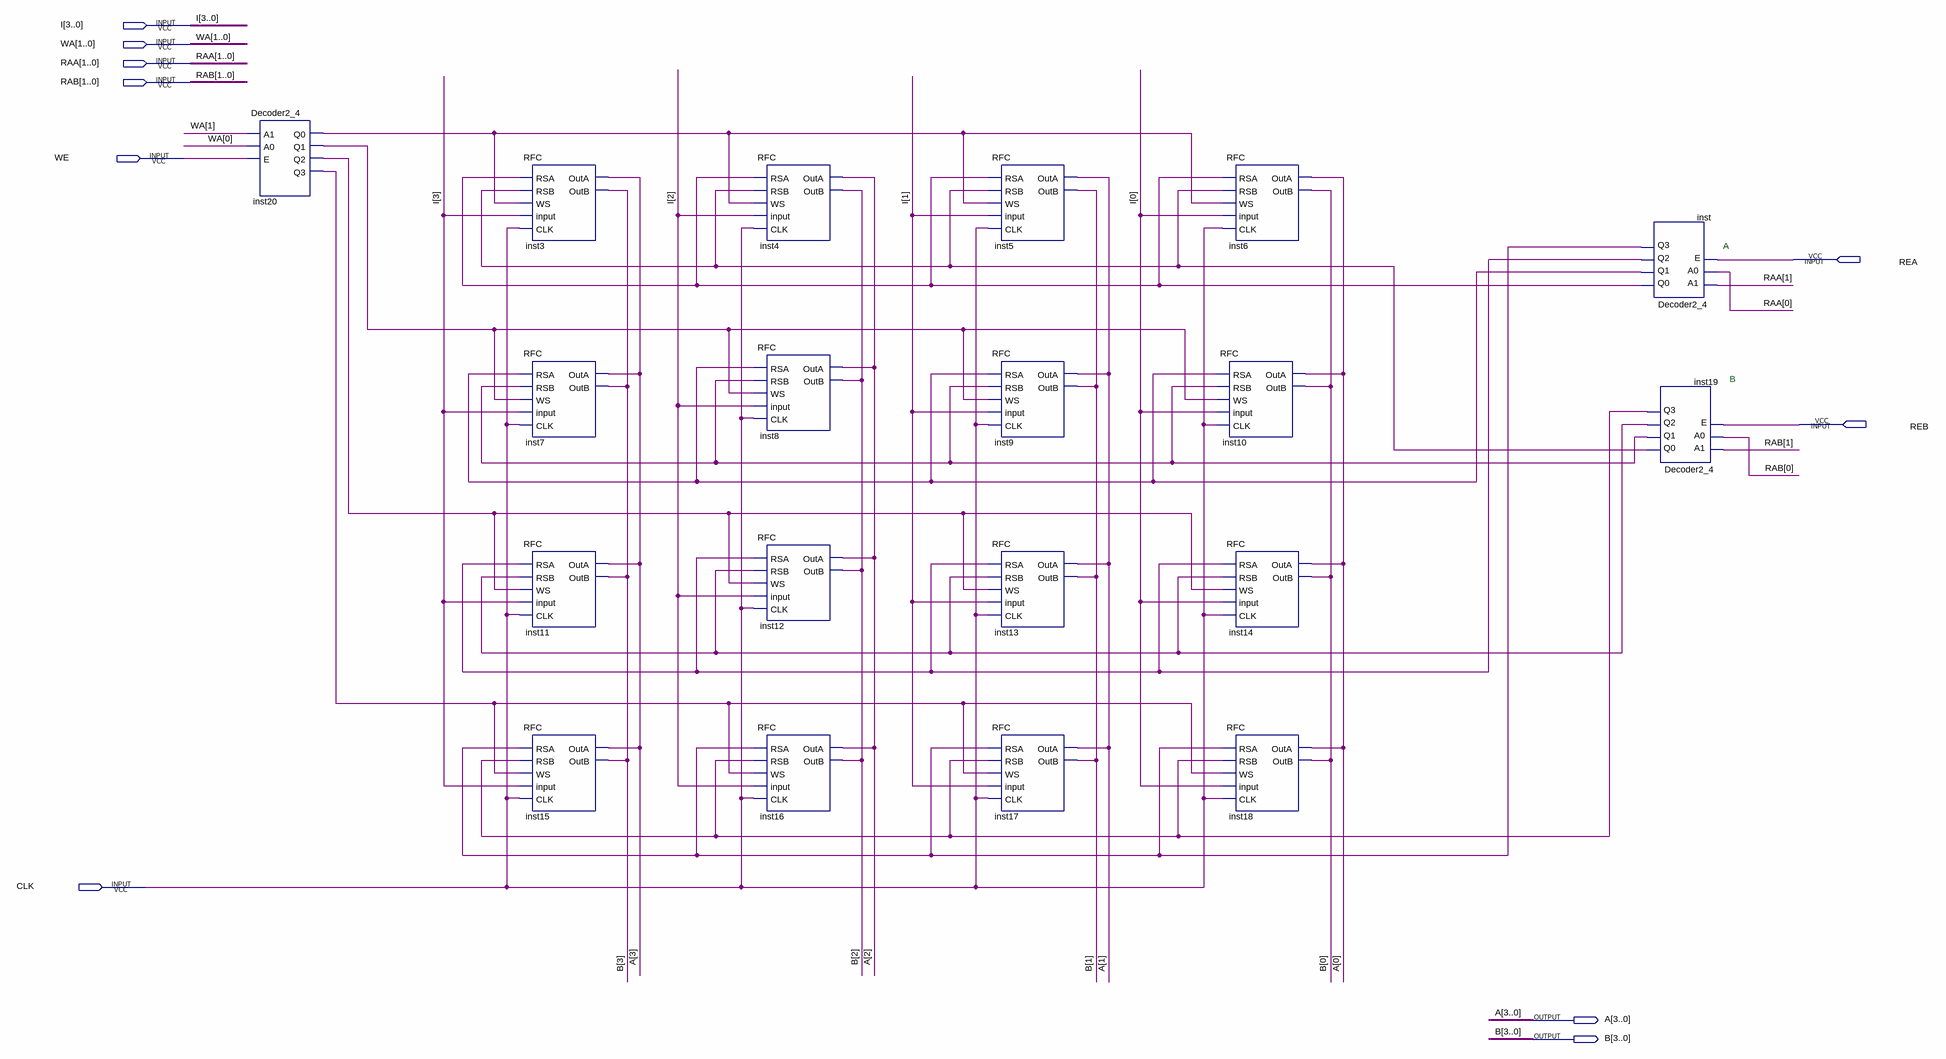
[diagram p0: schematic sheet]
// Quartus schematic register.bdf as structural Verilog: 19 symbols, 10 pins
module register (
  input  [3:0] I,
  input  [1:0] WA,
  input  [1:0] RAA,
  input  [1:0] RAB,
  input  WE,
  input  REA,
  input  REB,
  input  CLK,
  output [3:0] A,
  output [3:0] B
);

  wire inst19_q0, inst19_q1, inst19_q2, inst19_q3, inst20_q0, inst20_q1, inst20_q2, inst20_q3, inst_q0,
       inst_q1, inst_q2, inst_q3;

  Decoder2_4 inst20 (.A1(WA[1]), .A0(WA[0]), .E(WE), .Q0(inst20_q0), .Q1(inst20_q1), .Q2(inst20_q2), .Q3(inst20_q3));
  RFC inst3 (.RSA(inst_q0), .RSB(inst19_q0), .WS(inst20_q0), .\input (I[3]), .CLK(CLK), .OutA(A[3]), .OutB(B[3]));
  RFC inst7 (.RSA(inst_q1), .RSB(inst19_q1), .WS(inst20_q1), .\input (I[3]), .CLK(CLK), .OutA(A[3]), .OutB(B[3]));
  RFC inst11 (.RSA(inst_q2), .RSB(inst19_q2), .WS(inst20_q2), .\input (I[3]), .CLK(CLK), .OutA(A[3]), .OutB(B[3]));
  RFC inst15 (.RSA(inst_q3), .RSB(inst19_q3), .WS(inst20_q3), .\input (I[3]), .CLK(CLK), .OutA(A[3]), .OutB(B[3]));
  RFC inst4 (.RSA(inst_q0), .RSB(inst19_q0), .WS(inst20_q0), .\input (I[2]), .CLK(CLK), .OutA(A[2]), .OutB(B[2]));
  RFC inst8 (.RSA(inst_q1), .RSB(inst19_q1), .WS(inst20_q1), .\input (I[2]), .CLK(CLK), .OutA(A[2]), .OutB(B[2]));
  RFC inst12 (.RSA(inst_q2), .RSB(inst19_q2), .WS(inst20_q2), .\input (I[2]), .CLK(CLK), .OutA(A[2]), .OutB(B[2]));
  RFC inst16 (.RSA(inst_q3), .RSB(inst19_q3), .WS(inst20_q3), .\input (I[2]), .CLK(CLK), .OutA(A[2]), .OutB(B[2]));
  RFC inst5 (.RSA(inst_q0), .RSB(inst19_q0), .WS(inst20_q0), .\input (I[1]), .CLK(CLK), .OutA(A[1]), .OutB(B[1]));
  RFC inst9 (.RSA(inst_q1), .RSB(inst19_q1), .WS(inst20_q1), .\input (I[1]), .CLK(CLK), .OutA(A[1]), .OutB(B[1]));
  RFC inst13 (.RSA(inst_q2), .RSB(inst19_q2), .WS(inst20_q2), .\input (I[1]), .CLK(CLK), .OutA(A[1]), .OutB(B[1]));
  RFC inst17 (.RSA(inst_q3), .RSB(inst19_q3), .WS(inst20_q3), .\input (I[1]), .CLK(CLK), .OutA(A[1]), .OutB(B[1]));
  RFC inst6 (.RSA(inst_q0), .RSB(inst19_q0), .WS(inst20_q0), .\input (I[0]), .CLK(CLK), .OutA(A[0]), .OutB(B[0]));
  RFC inst10 (.RSA(inst_q1), .RSB(inst19_q1), .WS(inst20_q1), .\input (I[0]), .CLK(CLK), .OutA(A[0]), .OutB(B[0]));
  RFC inst14 (.RSA(inst_q2), .RSB(inst19_q2), .WS(inst20_q2), .\input (I[0]), .CLK(CLK), .OutA(A[0]), .OutB(B[0]));
  RFC inst18 (.RSA(inst_q3), .RSB(inst19_q3), .WS(inst20_q3), .\input (I[0]), .CLK(CLK), .OutA(A[0]), .OutB(B[0]));
  Decoder2_4 inst (.A1(RAA[1]), .A0(RAA[0]), .E(REA), .Q0(inst_q0), .Q1(inst_q1), .Q2(inst_q2), .Q3(inst_q3));
  Decoder2_4 inst19 (.A1(RAB[1]), .A0(RAB[0]), .E(REB), .Q0(inst19_q0), .Q1(inst19_q1), .Q2(inst19_q2), .Q3(inst19_q3));

  // Notes on the sheet:
  //   A
  //   B
endmodule
